# Altium schematic sheet OscMotherboard.SchDoc
size A; SheetNumber: 1; SheetTotal: 5
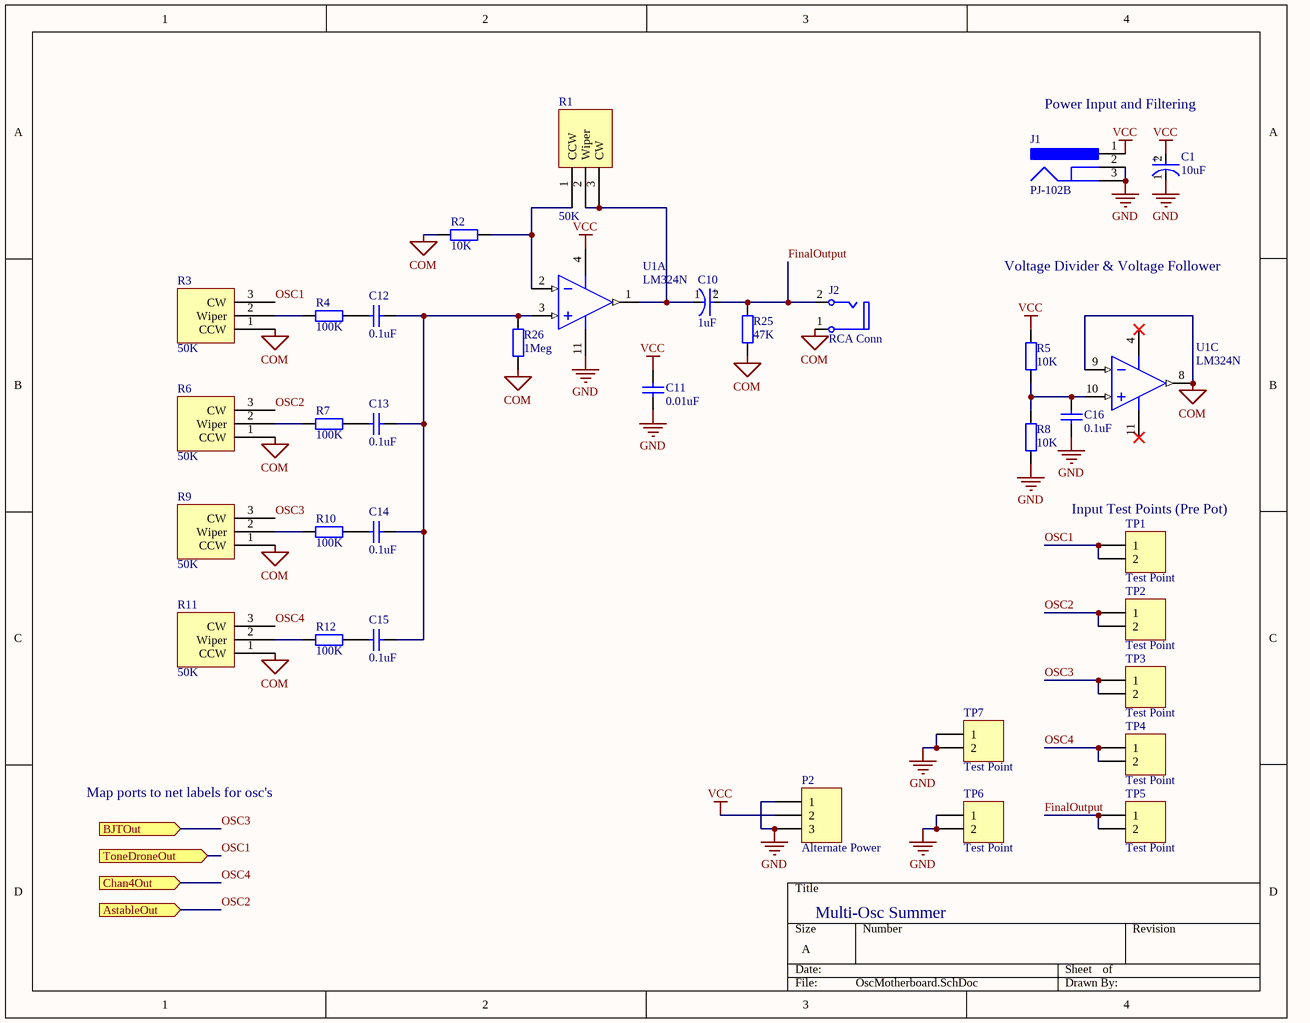
[diagram p0: OscMotherboard.SchDoc]

## Parts
C1  10uF  [FP-ESLE3-MFG]
C10  1uF  [FP-ESLE3-MFG]
C11  0.01uF  [KEMT-C315-THT-2]
C12  0.1uF  [KEMT-C315-THT-2]
C13  0.1uF  [KEMT-C315-THT-2]
C14  0.1uF  [KEMT-C315-THT-2]
C15  0.1uF  [KEMT-C315-THT-2]
C16  0.1uF  [KEMT-C315-THT-2]
J1  PJ-102B  [CUI-PJ-102B_V]
J2  RCA Conn  [CUI-RCJ-041_V]
P2  Alternate Power  [HDR1X3]
R1  50K  [TrimmerPot]
R2  10K  [AXIAL-0.4]
R3  50K  [TrimmerPot]
R4  100K  [AXIAL-0.4]
R5  10K  [AXIAL-0.4]
R6  50K  [TrimmerPot]
R7  100K  [AXIAL-0.4]
R8  10K  [AXIAL-0.4]
R9  50K  [TrimmerPot]
R10  100K  [AXIAL-0.4]
R11  50K  [TrimmerPot]
R12  100K  [AXIAL-0.4]
R25  47K  [AXIAL-0.4]
R26  1Meg  [AXIAL-0.4]
TP1  Test Point  [HDR1X2]
TP2  Test Point  [HDR1X2]
TP3  Test Point  [HDR1X2]
TP4  Test Point  [HDR1X2]
TP5  Test Point  [HDR1X2]
TP6  Test Point  [HDR1X2]
TP7  Test Point  [HDR1X2]
U1  LM324N  [N0014A]  (parts A,C of 4)

## Ports
AstableOut (in), BJTOut (in), Chan4Out (in), ToneDroneOut (in)

## Nets
COM: J2.1 R2.2 R3.1(CCW) R6.1(CCW) R9.1(CCW) R11.1(CCW) R25.2 R26.2 U1.8(OUT3) U1.9(IN3-)
GND: C1.1(C) C11.2 C16.2 J1.2 J1.3 P2.1 P2.3 R8.2 TP6.1 TP6.2 TP7.1 TP7.2 U1.11(GND)
VCC: C1.2(A) C11.1 J1.1 P2.2 R5.1 U1.4(V+)
FinalOutput: C10.2(A) J2.2 R25.1 TP5.1 TP5.2
OSC1: R3.3(CW) TP1.1 TP1.2 ; port ToneDroneOut
OSC2: R6.3(CW) TP2.1 TP2.2 ; port AstableOut
OSC3: R9.3(CW) TP3.1 TP3.2 ; port BJTOut
OSC4: R11.3(CW) TP4.1 TP4.2 ; port Chan4Out
NetC10_1: C10.1(C) R1.2(Wiper) R1.3(CW) U1.1(OUT1)
NetC12_1: C12.1 C13.1 C14.1 C15.1 R26.1 U1.3(IN1+)
NetC12_2: C12.2 R4.1
NetC13_2: C13.2 R7.1
NetC14_2: C14.2 R10.1
NetC15_2: C15.2 R12.1
NetC16_1: C16.1 R5.2 R8.1 U1.10(IN3+)
NetR1_1: R1.1(CCW) R2.1 U1.2(IN1-)
NetR3_2: R3.2(Wiper) R4.2
NetR6_2: R6.2(Wiper) R7.2
NetR9_2: R9.2(Wiper) R10.2
NetR11_2: R11.2(Wiper) R12.2

## Notes on the sheet
- Power Input and Filtering
- Voltage Divider & Voltage Follower
- (near TP1) Input Test Points (Pre Pot)
- Map ports to net labels for osc's
- Multi-Osc Summer
- (in symbol CMP-03015-000004-1) +

## Library data of the parts
C1 C10 = CMP-03015-000004-1: CAP ALUM 10UF 20% 100V THRU HOLE; Manufacturer Part Number: ESL106M100AE3AA; Manufacturer: kemet; Life: 10000Hours; Ripple Current: 280mA; Dissipation Factor: 9%; Esr: 0.68Ω; Leakage Current: 10uA; Material: Aluminum; Tolerance: 20%; Voltage Rating: 100V; Device Class L3: Aluminum Electrolytic Capacitors; Value: 10uF; Height: 12.5mm; Temperature Range High: +105°C; Capacitance: 10uF; ComponentLink2Description: Datasheet; Mouser Description: Cap, 10UF, 100V, Alu Elec, Radial; Category: Cap; Octopart: https://octopart.com/esl106m100ae3aa-kemet-84758885; Temperature: -40°C to +105°C; RoHS: TRUE; Device Class L1: Passive Components; Digikey Description: CAP ALUM 10UF 20% 100V THRU HOLE; ComponentLink2URL: https://content.kemet.com/datasheets/KEM_A4074_ESL.pdf; Device Class L2: Capacitors; Temperature Range Low: -40°C; Package: ESLE3; Automotive: No; Lead Free: Yes
C11-C16 = CMP-1664-00007-1: Capacitor, Ceramic, 0.01 uF, +/- 10%, 100 V, X7R, -55 to 125 degC, 2-Pin THD, RoHS, Bulk; Output Voltage: 70 V; Case\Package: PDIP; Forward Current: 60 mA; Nominal Vf: 1.3 V; Forward Voltage: 1.5 V; Channels: 2; Max Power Dissipation: 400 mW; Vce Max: 500 mV; ComponentLink1Description: Manufacturer URL; ComponentLink2Description: Datasheet; Packaging: Rail/Tube; RoHSCompliant: true; Package Quantity: 2000; PackageReference: C315-THT-2; Min Operating Temperature: -55 degC; Max Operating Temperature: 100 degC; Radiation Hardening: No; ComponentLink1URL: http://www.kemet.com/; DatasheetVersion: Aug-16; Pins: 16; PackageDescription: 2-Pin Through Hole Device, Body 3.81 x 2.54 mm; REACH SVHC: Unknown; Mount: Through Hole; ComponentLink2URL: http://capacitoredge.kemet.com/capedge2/DataSheet/Datasheet-C315C103K1R5TA.pdf?pn=C315C103K1R5TA{BULK}
J1 = CMP-2000-06900-1: Through Hole Right Angle DC Power Jack, 2.5 A, 2.5 mm Center Pin, 3 Position, -25 to 85 degC, RoHS, Bulk; Manufacturer: CUIInc.; Insulation Resistance: 100MOhms; Inside Contact Diameter: 2.5mm; Outside Contact Diameter: 6.5mm; Voltage Rating: 24V; Current Rating: 2.5A; Brand: CUI; Datasheet URL: http://www.cui.com/product/resource/pj-102b.pdf; Housing Material: PolybutyleneTerephthalate(PBT); Operating Temperature Range: -25Cto+85C; Package Reference: PJ-102B; Factory Pack Quantity: 280; RoHS: True; Contact Material: Copper; Datasheet Version: Rev. 1.03, 04/2016; Product: Jacks; Mounting Angle: Right; Mounting Style: ThroughHole; Flammability Rating: UL94V-0; Product Category: DCPowerConnectors; Contact Gender: Male; Termination Style: ThroughHole; Manufacturer URL: http://www.cui.com/; Mounting Technology: ThroughHole; Package Description: 3-Pin Through Hole Device, Body 14.4 x 9 mm, Height 11 mm; Contact Plating: Nickel; Packaging: Bulk; Connector Type: DCPowerJack
J2 = CMP-1692-00002-1: Female RCJ Jack, 2 Position, Height 11.724 mm, Tail Length 4 mm, RoHS, Bulk; Case\Package: Metal; Connector Type: HDMI; Current Rating: 500 mA; Voltage Rating: 40 V; Length: 16.2 mm; Pins: 19; ComponentLink1URL: http://www.cui.com/; ComponentLink1Description: Manufacturer URL; Packaging: Tape and Reel; Lead Pitch: 0.5 mm; PackageDescription: Female RCJ Jack, 2 Position, Height 11.724 mm, Tail Length 4 mm; RoHSCompliant: true; Min Operating Temperature: -55 degC; Height: 6.1 mm; Contact Material: Copper; REACH SVHC: No SVHC; DatasheetVersion: Rev. B, 02/2012; ComponentLink2Description: Datasheet; Contact Plating: Gold; Colour: Black; Max Operating Temperature: 85 degC; Mount: Surface Mount; Package Quantity: 400; Gender: Female; ComponentLink2URL: http://www.cui.com/product/resource/rcj-04x.pdf; PackageReference: RCJ-041
P2 = Header 3: Header, 3-Pin; LatestRevisionDate: 17-Jul-2002; LatestRevisionNote: Re-released for DXP Platform.; Publisher: Altium Limited
R1 R3 R6 R9 R11 = TrimmerPot
R2 R4 R5 R7 R8 R10 R12 R25 R26 = Res2: Resistor; Value: 1K; Published: 8-Jun-2000; LatestRevisionDate: 17-Jul-2002; LatestRevisionNote: Re-released for DXP Platform.; PackageReference: AXIAL-0.4; Publisher: Altium Limited; PackageDescription: Axial Device, Thru-Hole; 2 Leads; 0.4 in Pin Spacing
TP1-TP7 = Header 2: Header, 2-Pin; LatestRevisionDate: 17-Jul-2002; LatestRevisionNote: Re-released for DXP Platform.; Publisher: Altium Limited
U1 = CMP-0055-00082-3: Low Power Quad Operational Amplifier, 14-pin MDIP; Manufacturer: Texas Instruments; CompType: Amplifiers; PowerWise: N; PackageTopMarking: NSUZXYYTTE#*LM324N; PackageDescription: MDIP, .750 x .250 x.130in, 14 Lead, .100in Pitch; Package Reference: N0014A; RoHS: N; Code_JEDEC: MS-001-AA; ComponentLink1URL: http://www.ti.com/general/docs/lit/getliterature.tsp?genericPartNumber=LM324&fileType=pdf; ComponentLink1Description: Datasheet URL; PinCount: 14